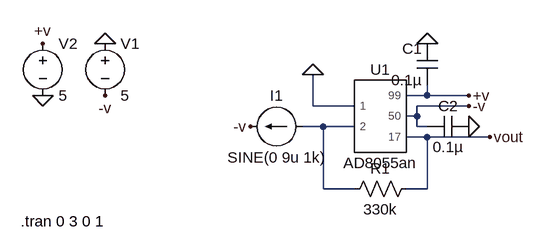
[diagram p0: schematic RXV2.asc]
RXV2.asc, the LTspice schematic file:
Version 4
SHEET 1 880 680
WIRE 320 128 320 112
WIRE 320 128 288 128
WIRE 384 128 320 128
WIRE 144 144 144 96
WIRE 208 144 144 144
WIRE 384 144 304 144
WIRE 304 160 304 144
WIRE 304 160 288 160
WIRE 160 176 128 176
WIRE 208 176 160 176
WIRE 304 176 304 160
WIRE 320 176 304 176
WIRE 320 192 288 192
WIRE 416 192 320 192
WIRE 160 272 160 176
WIRE 208 272 160 272
WIRE 320 272 320 192
WIRE 320 272 288 272
FLAG -272 128 0
FLAG -176 48 0
FLAG -272 48 +v
FLAG -176 128 -v
FLAG 48 176 -v
FLAG 144 96 0
FLAG 384 144 -v
FLAG 384 128 +v
FLAG 416 192 vout
FLAG 384 176 0
FLAG 320 48 0
SYMBOL AD8055an 240 160 R0
SYMATTR InstName U1
SYMBOL current 128 176 R90
WINDOW 0 -32 40 VBottom 2
WINDOW 3 32 40 VTop 2
WINDOW 123 0 0 Left 0
WINDOW 39 0 0 Left 0
SYMATTR InstName I1
SYMATTR Value SINE(0 9u 1k)
SYMBOL voltage -176 32 R0
WINDOW 123 0 0 Left 0
WINDOW 39 0 0 Left 0
SYMATTR InstName V1
SYMATTR Value 5
SYMBOL voltage -272 32 R0
WINDOW 123 0 0 Left 0
WINDOW 39 0 0 Left 0
SYMATTR InstName V2
SYMATTR Value 5
SYMBOL res 304 256 R90
WINDOW 0 0 56 VBottom 2
WINDOW 3 32 56 VTop 2
SYMATTR InstName R1
SYMATTR Value 330k
SYMBOL cap 336 112 R180
WINDOW 0 24 56 Left 2
WINDOW 3 24 8 Left 2
SYMATTR InstName C1
SYMATTR Value 0.1µ
SYMBOL cap 320 192 R270
WINDOW 0 32 32 VTop 2
WINDOW 3 0 32 VBottom 2
SYMATTR InstName C2
SYMATTR Value 0.1µ
TEXT -306 322 Left 2 !.tran 0 3 0 1

The netlist it stands for:
* RXV2.asc
XU1 0 N001 +v -v vout AD8055an  ; pins 1 2 99 50 17
I1 N001 -v SINE(0 9u 1k)
V1 0 -v 5
V2 +v 0 5
R1 vout N001 330k
C1 +v 0 0.1µ
C2 -v 0 0.1µ
.tran 0 3 0 1
.lib C:\Users\tommy\Desktop\ad8055.cir
.backanno
.end